# Altium schematic sheet OP AMPS.SchDoc
size 420 x 297 mm; Organization: Altium Limited; Address1: L3, 12a Rodborough Rd; Address2: Frenchs Forest; Address3: NSW; Address4: Australia 2086; Revision: R0; SheetNumber: 5; SheetTotal: 8
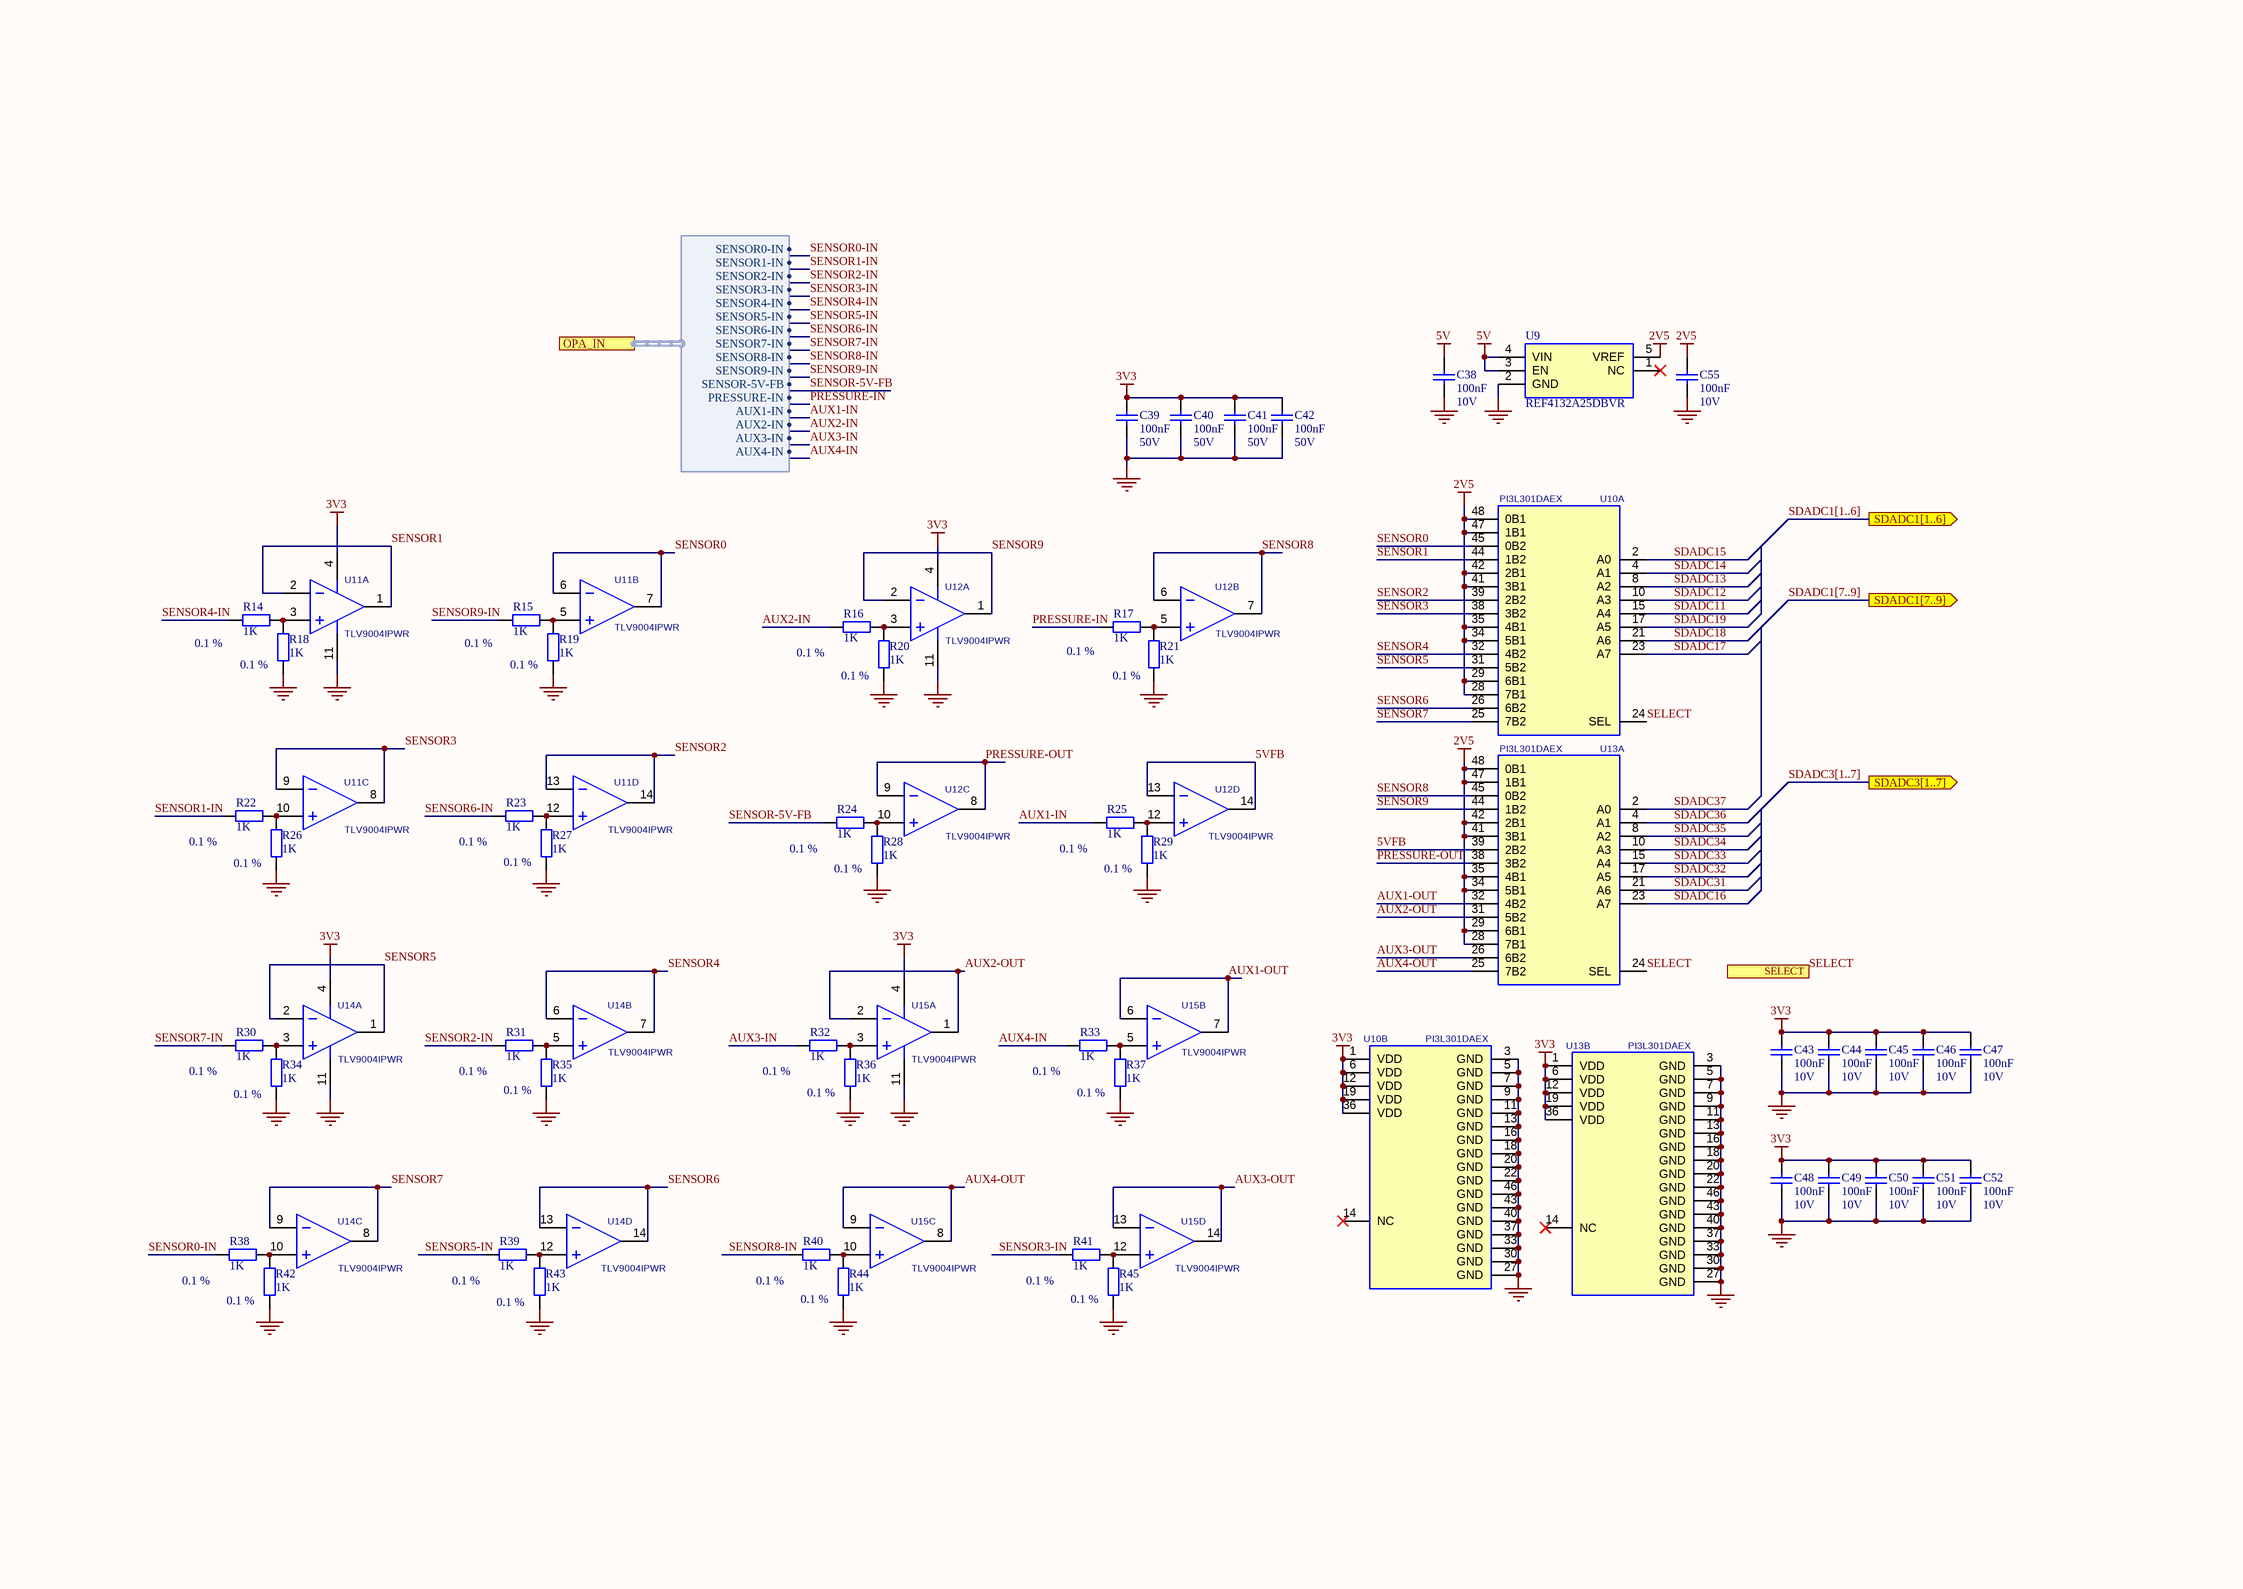
[diagram p0: OP AMPS.SchDoc]

## Parts
C38  Value 1: 100nF  Value 2: 10V  [CAPC1608N]  (hidden comment: Capacitor)
C39  Value 1: 100nF  Value 2: 50V  [CAPC1608N]  (hidden comment: Capacitor)
C40  Value 1: 100nF  Value 2: 50V  [CAPC1608N]  (hidden comment: Capacitor)
C41  Value 1: 100nF  Value 2: 50V  [CAPC1608N]  (hidden comment: Capacitor)
C42  Value 1: 100nF  Value 2: 50V  [CAPC1608N]  (hidden comment: Capacitor)
C43  Value 1: 100nF  Value 2: 10V  [CAPC1608N]  (hidden comment: Capacitor)
C44  Value 1: 100nF  Value 2: 10V  [CAPC1608N]  (hidden comment: Capacitor)
C45  Value 1: 100nF  Value 2: 10V  [CAPC1608N]  (hidden comment: Capacitor)
C46  Value 1: 100nF  Value 2: 10V  [CAPC1608N]  (hidden comment: Capacitor)
C47  Value 1: 100nF  Value 2: 10V  [CAPC1608N]  (hidden comment: Capacitor)
C48  Value 1: 100nF  Value 2: 10V  [CAPC1608N]  (hidden comment: Capacitor)
C49  Value 1: 100nF  Value 2: 10V  [CAPC1608N]  (hidden comment: Capacitor)
C50  Value 1: 100nF  Value 2: 10V  [CAPC1608N]  (hidden comment: Capacitor)
C51  Value 1: 100nF  Value 2: 10V  [CAPC1608N]  (hidden comment: Capacitor)
C52  Value 1: 100nF  Value 2: 10V  [CAPC1608N]  (hidden comment: Capacitor)
C55  Value 1: 100nF  Value 2: 10V  [CAPC1608N]  (hidden comment: Capacitor)
R14  Value 1: 1K  TOL: 0.1 %  [RESC1608N]  (hidden comment: Resistor)
R15  Value 1: 1K  TOL: 0.1 %  [RESC1608N]  (hidden comment: Resistor)
R16  Value 1: 1K  TOL: 0.1 %  [RESC1608N]  (hidden comment: Resistor)
R17  Value 1: 1K  TOL: 0.1 %  [RESC1608N]  (hidden comment: Resistor)
R18  Value 1: 1K  TOL: 0.1 %  [RESC1608N]  (hidden comment: Resistor)
R19  Value 1: 1K  TOL: 0.1 %  [RESC1608N]  (hidden comment: Resistor)
R20  Value 1: 1K  TOL: 0.1 %  [RESC1608N]  (hidden comment: Resistor)
R21  Value 1: 1K  TOL: 0.1 %  [RESC1608N]  (hidden comment: Resistor)
R22  Value 1: 1K  TOL: 0.1 %  [RESC1608N]  (hidden comment: Resistor)
R23  Value 1: 1K  TOL: 0.1 %  [RESC1608N]  (hidden comment: Resistor)
R24  Value 1: 1K  TOL: 0.1 %  [RESC1608N]  (hidden comment: Resistor)
R25  Value 1: 1K  TOL: 0.1 %  [RESC1608N]  (hidden comment: Resistor)
R26  Value 1: 1K  TOL: 0.1 %  [RESC1608N]  (hidden comment: Resistor)
R27  Value 1: 1K  TOL: 0.1 %  [RESC1608N]  (hidden comment: Resistor)
R28  Value 1: 1K  TOL: 0.1 %  [RESC1608N]  (hidden comment: Resistor)
R29  Value 1: 1K  TOL: 0.1 %  [RESC1608N]  (hidden comment: Resistor)
R30  Value 1: 1K  TOL: 0.1 %  [RESC1608N]  (hidden comment: Resistor)
R31  Value 1: 1K  TOL: 0.1 %  [RESC1608N]  (hidden comment: Resistor)
R32  Value 1: 1K  TOL: 0.1 %  [RESC1608N]  (hidden comment: Resistor)
R33  Value 1: 1K  TOL: 0.1 %  [RESC1608N]  (hidden comment: Resistor)
R34  Value 1: 1K  TOL: 0.1 %  [RESC1608N]  (hidden comment: Resistor)
R35  Value 1: 1K  TOL: 0.1 %  [RESC1608N]  (hidden comment: Resistor)
R36  Value 1: 1K  TOL: 0.1 %  [RESC1608N]  (hidden comment: Resistor)
R37  Value 1: 1K  TOL: 0.1 %  [RESC1608N]  (hidden comment: Resistor)
R38  Value 1: 1K  TOL: 0.1 %  [RESC1608N]  (hidden comment: Resistor)
R39  Value 1: 1K  TOL: 0.1 %  [RESC1608N]  (hidden comment: Resistor)
R40  Value 1: 1K  TOL: 0.1 %  [RESC1608N]  (hidden comment: Resistor)
R41  Value 1: 1K  TOL: 0.1 %  [RESC1608N]  (hidden comment: Resistor)
R42  Value 1: 1K  TOL: 0.1 %  [RESC1608N]  (hidden comment: Resistor)
R43  Value 1: 1K  TOL: 0.1 %  [RESC1608N]  (hidden comment: Resistor)
R44  Value 1: 1K  TOL: 0.1 %  [RESC1608N]  (hidden comment: Resistor)
R45  Value 1: 1K  TOL: 0.1 %  [RESC1608N]  (hidden comment: Resistor)
U9  REF4132A25DBVR  [SOT-23-5]
U10  PI3L301DAEX  [SOP-48]  (parts A,B of 2)
U11  TLV9004IPWR  [TSSOP-14]  (parts A,B,C,D of 4)
U12  TLV9004IPWR  [TSSOP-14]  (parts A,B,C,D of 4)
U13  PI3L301DAEX  [SOP-48]  (parts A,B of 2)
U14  TLV9004IPWR  [TSSOP-14]  (parts A,B,C,D of 4)
U15  TLV9004IPWR  [TSSOP-14]  (parts A,B,C,D of 4)

## Ports
OPA_IN (harness OPA_IN), SDADC1[1..6] (out), SDADC1[7..9] (out), SDADC3[1..7] (out), SELECT (in)

## Harnesses
OPA_IN: SENSOR2-IN, SENSOR3-IN, SENSOR4-IN, SENSOR5-IN, SENSOR6-IN, SENSOR7-IN, SENSOR8-IN, SENSOR9-IN, SENSOR-5V-FB, PRESSURE-IN, AUX1-IN, AUX2-IN, SENSOR1-IN, AUX3-IN, SENSOR0-IN, AUX4-IN

## Nets
2V5: C55.2 U9.5(VREF) U10.28(7B1) U10.29(6B1) U10.34(5B1) U10.35(4B1) U10.41(3B1) U10.42(2B1) U10.47(1B1) U10.48(0B1) U13.28(7B1) U13.29(6B1) U13.34(5B1) U13.35(4B1) U13.41(3B1) U13.42(2B1) U13.47(1B1) U13.48(0B1)
3V3: C39.1 C40.1 C41.1 C42.1 C43.2 C44.2 C45.2 C46.2 C47.2 C48.2 C49.2 C50.2 C51.2 C52.2 U10.1(VDD) U10.6(VDD) U10.12(VDD) U10.19(VDD) U10.36(VDD) U11.4(+V) U12.4(+V) U13.1(VDD) U13.6(VDD) U13.12(VDD) U13.19(VDD) U13.36(VDD) U14.4(+V) U15.4(+V)
5V: C38.2 U9.3(EN) U9.4(VIN)
GND: C38.1 C39.2 C40.2 C41.2 C42.2 C43.1 C44.1 C45.1 C46.1 C47.1 C48.1 C49.1 C50.1 C51.1 C52.1 C55.1 R18.2 R19.2 R20.2 R21.2 R26.2 R27.2 R28.2 R29.2 R34.2 R35.2 R36.2 R37.2 R42.2 R43.2 R44.2 R45.2 U9.2(GND) U10.3(GND) U10.5(GND) U10.7(GND) U10.9(GND) U10.11(GND) U10.13(GND) U10.16(GND) U10.18(GND) U10.20(GND) U10.22(GND) U10.27(GND) U10.30(GND) U10.33(GND) U10.37(GND) U10.40(GND) U10.43(GND) U10.46(GND) U11.11(-V) U12.11(-V) U13.3(GND) U13.5(GND) U13.7(GND) U13.9(GND) U13.11(GND) U13.13(GND) U13.16(GND) U13.18(GND) U13.20(GND) U13.22(GND) U13.27(GND) U13.30(GND) U13.33(GND) U13.37(GND) U13.40(GND) U13.43(GND) U13.46(GND) U14.11(-V) U15.11(-V)
5VFB: U12.13(–IN_D) U12.14(OUT_D) U13.39(2B2)
AUX1-IN: R25.1 ; port OPA_IN.AUX1-IN
AUX1-OUT: U13.32(4B2) U15.6(–IN_B) U15.7(OUT_B)
AUX2-IN: R16.1 ; port OPA_IN.AUX2-IN
AUX2-OUT: U13.31(5B2) U15.1(OUT_A) U15.2(-IN_A)
AUX3-IN: R32.1 ; port OPA_IN.AUX3-IN
AUX3-OUT: U13.26(6B2) U15.13(–IN_D) U15.14(OUT_D)
AUX4-IN: R33.1 ; port OPA_IN.AUX4-IN
AUX4-OUT: U13.25(7B2) U15.8(OUT_C) U15.9(–IN_C)
PRESSURE-IN: R17.1 ; port OPA_IN.PRESSURE-IN
PRESSURE-OUT: U12.8(OUT_C) U12.9(–IN_C) U13.38(3B2)
SDADC11: U10.15(A4)
SDADC12: U10.10(A3)
SDADC13: U10.8(A2)
SDADC14: U10.4(A1)
SDADC15: U10.2(A0)
SDADC16: U13.23(A7)
SDADC17: U10.23(A7)
SDADC18: U10.21(A6)
SDADC19: U10.17(A5)
SDADC31: U13.21(A6)
SDADC32: U13.17(A5)
SDADC33: U13.15(A4)
SDADC34: U13.10(A3)
SDADC35: U13.8(A2)
SDADC36: U13.4(A1)
SDADC37: U13.2(A0)
SELECT: U10.24(SEL) U13.24(SEL) ; port SELECT
SENSOR0: U10.45(0B2) U11.6(–IN_B) U11.7(OUT_B)
SENSOR0-IN: R38.1 ; port OPA_IN.SENSOR0-IN
SENSOR1: U10.44(1B2) U11.1(OUT_A) U11.2(-IN_A)
SENSOR1-IN: R22.1 ; port OPA_IN.SENSOR1-IN
SENSOR2: U10.39(2B2) U11.13(–IN_D) U11.14(OUT_D)
SENSOR2-IN: R31.1 ; port OPA_IN.SENSOR2-IN
SENSOR3: U10.38(3B2) U11.8(OUT_C) U11.9(–IN_C)
SENSOR3-IN: R41.1 ; port OPA_IN.SENSOR3-IN
SENSOR4: U10.32(4B2) U14.6(–IN_B) U14.7(OUT_B)
SENSOR4-IN: R14.1 ; port OPA_IN.SENSOR4-IN
SENSOR5: U10.31(5B2) U14.1(OUT_A) U14.2(-IN_A)
SENSOR5-IN: R39.1 ; port OPA_IN.SENSOR5-IN
SENSOR6: U10.26(6B2) U14.13(–IN_D) U14.14(OUT_D)
SENSOR6-IN: R23.1 ; port OPA_IN.SENSOR6-IN
SENSOR7: U10.25(7B2) U14.8(OUT_C) U14.9(–IN_C)
SENSOR7-IN: R30.1 ; port OPA_IN.SENSOR7-IN
SENSOR8: U12.6(–IN_B) U12.7(OUT_B) U13.45(0B2)
SENSOR8-IN: R40.1 ; port OPA_IN.SENSOR8-IN
SENSOR9: U12.1(OUT_A) U12.2(-IN_A) U13.44(1B2)
SENSOR9-IN: R15.1 ; port OPA_IN.SENSOR9-IN
SENSOR-5V-FB: R24.1 ; port OPA_IN.SENSOR-5V-FB
NetR14_2: R14.2 R18.1 U11.3(+IN_A)
NetR15_2: R15.2 R19.1 U11.5(+IN_B)
NetR16_2: R16.2 R20.1 U12.3(+IN_A)
NetR17_2: R17.2 R21.1 U12.5(+IN_B)
NetR22_2: R22.2 R26.1 U11.10(+IN_C)
NetR23_2: R23.2 R27.1 U11.12(+IN_D)
NetR24_2: R24.2 R28.1 U12.10(+IN_C)
NetR25_2: R25.2 R29.1 U12.12(+IN_D)
NetR30_2: R30.2 R34.1 U14.3(+IN_A)
NetR31_2: R31.2 R35.1 U14.5(+IN_B)
NetR32_2: R32.2 R36.1 U15.3(+IN_A)
NetR33_2: R33.2 R37.1 U15.5(+IN_B)
NetR38_2: R38.2 R42.1 U14.10(+IN_C)
NetR39_2: R39.2 R43.1 U14.12(+IN_D)
NetR40_2: R40.2 R44.1 U15.10(+IN_C)
NetR41_2: R41.2 R45.1 U15.12(+IN_D)

Not connected (* = marked no-connect by the designer): U9 1(NC)*; U10 14(NC)*; U13 14(NC)*

## Buses and harness runs
bus SDADC1[1..6] = port SDADC1[1..6]
bus SDADC1[7..9] = port SDADC1[7..9]
bus SDADC3[1..7] = port SDADC3[1..7]

## Notes on the sheet
- THIS DOCUMENT AND THE DATA DISCLOSED HEREIN OR
- HEREWITH IS THE PROPERTY OF ALTIUM LIMITED AND MAY
- DWG NO:
- REVISION
- REV:
- DESCRIPTION
- DATE
- APPROVED
- BE FREELY DISTRIBUTED IN WHOLE. NO RIGHTS ARE
- RESERVED OR EXPRESS OR IMPLIED WARANTEE GIVEN.
- ENG:
- APPROVALS
- PROJECT
- DSN:
- CHK:
- REFERENCE DOCUMENTS
- PROJECT REVISION:
- TITLE
- DOCUMENT REVISION:
- DESIGN ITEM:
- BOM:
- FAB DWG:
- PCB DWG:
- ASSY DWG:
- SCALE:
- A3
- SIZE
- CAGE CODE
- FILE NAME
- DWG NO.
- SHEET
- OF
- REV

## Library data of the parts
C38 C43-C52 C55 = CAP-000000005: MAN: KEMET; MANREF: C0603X104K8RACTU; DES: C0603X104K8RACTU -  Condensateur céramique multicouche CMS, 0.1 µF, 10 V, 0603 [1608 Metric], ± 10%, X7R; TOL: 10%; FTP: 0603; SUP: Farnell; SUPREF: 2904937; NOTE: _; Part Number: CAP-000000005
C39-C42 = CAP-000000002: MAN: VISHAY; MANREF: VJ0603V104ZXAPW1BC; DES: VJ0603V104ZXAPW1BC -  Condensateur céramique multicouche CMS, 0.1 µF, 50 V, 0603 [1608 Metric], +80%, -20%, Y5V; TOL: +80% -20%; FTP: 0603; SUP: Farnell; SUPREF: 2896408; NOTE: _; Part Number: CAP-000000002
R14-R45 = RES-000000112: MAN: TE Connectivity; MANREF: CPF0603B1K0E1; DES: Thin Film Resistors - SMD 1KOhm .063W 25PPM; Value 2: 0.625W; FTP: 0603; SUP: Mouser; SUPREF: 279-CPF0603B1K0E1; NOTE: _; Part Number: RES-000000112
U9 = VRF-000000002: MAN: Texas Instruments; DES: Voltage References 12-ppm/ C low-noise low-power precision voltage reference; Value 1: 2.5 V; Value 2: _; TOL: 0.05 %; SUP: Mouser; SUPREF: 595-REF4132A25DBVR; Part Number: VRF-000000002; MANREF: REF4132A25DBVR; FTP: SOT-23-5; NOTE: _
U10 U13 = MIS-000000001: MAN: DIODES INC; DES: Commutateur analogique, 8 Canal(aux), SPDT, 8 ohm, 3V à 3.6V, TSSOP, 48 Broche(s); Value 1: _; SUP: Farneel; SUPREF: 3483212; Part Number: MIS-000000001; MANREF: PI3L301DAEX; Value 2: _; TOL: _; FTP: SOP-48; NOTE: _
U11 U12 U14 U15 = OPA-000000002: MAN: Texas Instrument; DES: Operational Amplifiers - Op Amps 4-Channel, 1MHz, RRIO, 1.8V to 5.5V Operational Amplifier for Cost-Optimized Systems 14-TSSOP -40 to 125; Value 1: _; SUP: Mouser; SUPREF: 595-TLV9004IPWR; Part Number: OPA-000000002; MANREF: TLV9004IPWR; Value 2: _; TOL: _; FTP: TSSOP-14; NOTE: _